# EAGLE design MakespaceBadge-5x5 (EAGLE 7.4.0)
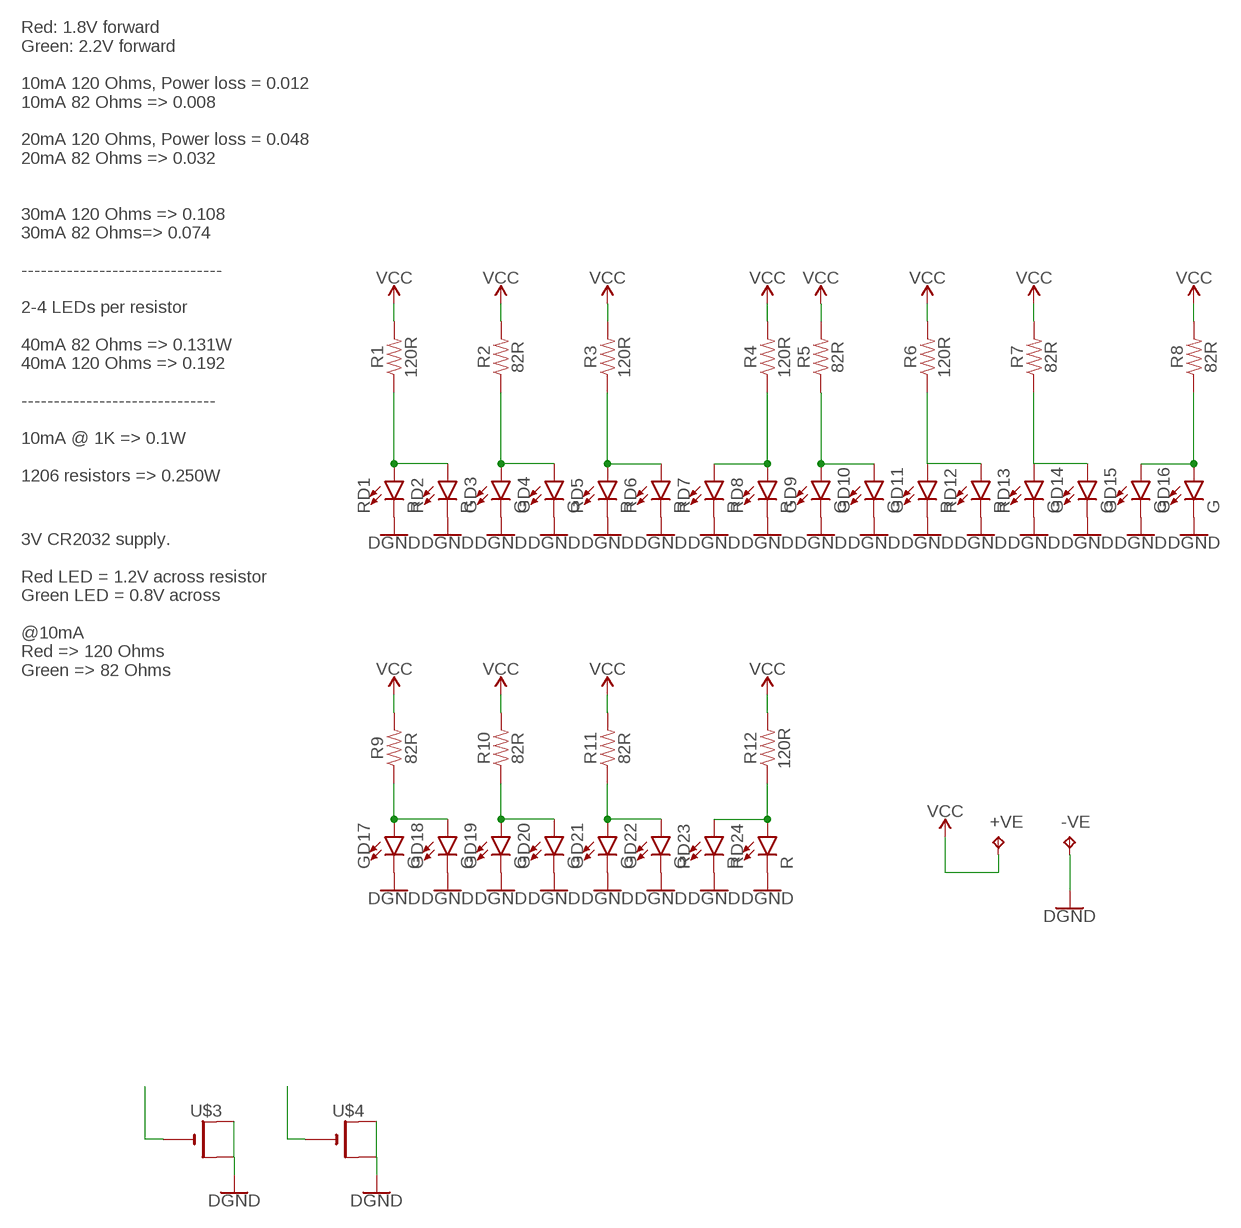
[diagram p0: schematic, sheet 1]

## Parts
+VE  TPTP20SQ  [TP20SQ]
-VE  TPTP20SQ  [TP20SQ]
GD3  G  LED3MM  [LED_3MM]
GD4  G  LED3MM  [LED_3MM]
GD9  G  LED3MM  [LED_3MM]
GD10  G  LED3MM  [LED_3MM]
GD11  R  LED3MM  [LED_3MM]
GD14  G  LED3MM  [LED_3MM]
GD15  G  LED3MM  [LED_3MM]
GD16  G  LED3MM  [LED_3MM]
GD17  G  LED3MM  [LED_3MM]
GD18  G  LED3MM  [LED_3MM]
GD19  G  LED3MM  [LED_3MM]
GD20  G  LED3MM  [LED_3MM]
GD21  G  LED3MM  [LED_3MM]
GD22  G  LED3MM  [LED_3MM]
R1  120R  RESISTOR1206  [1206]
R2  82R  RESISTOR1206  [1206]
R3  120R  RESISTOR1206  [1206]
R4  120R  RESISTOR1206  [1206]
R5  82R  RESISTOR1206  [1206]
R6  120R  RESISTOR1206  [1206]
R7  82R  RESISTOR1206  [1206]
R8  82R  RESISTOR1206  [1206]
R9  82R  RESISTOR1206  [1206]
R10  82R  RESISTOR1206  [1206]
R11  82R  RESISTOR1206  [1206]
R12  120R  RESISTOR1206  [1206]
RD1  R  LED3MM  [LED_3MM]
RD2  R  LED3MM  [LED_3MM]
RD5  R  LED3MM  [LED_3MM]
RD6  R  LED3MM  [LED_3MM]
RD7  R  LED3MM  [LED_3MM]
RD8  R  LED3MM  [LED_3MM]
RD12  R  LED3MM  [LED_3MM]
RD13  G  LED3MM  [LED_3MM]
RD23  R  LED3MM  [LED_3MM]
RD24  R  LED3MM  [LED_3MM]
U$3  CR1220SMT  [CR1220-SMD]
U$4  CR1220SMT  [CR1220-SMD]

## Nets
GND: -VE.TP GD3.K(C) GD4.K(C) GD9.K(C) GD10.K(C) GD11.K(C) GD14.K(C) GD15.K(C) GD16.K(C) GD17.K(C) GD18.K(C) GD19.K(C) GD20.K(C) GD21.K(C) GD22.K(C) RD1.K(C) RD2.K(C) RD5.K(C) RD6.K(C) RD7.K(C) RD8.K(C) RD12.K(C) RD13.K(C) RD23.K(C) RD24.K(C) U$3.+$1(+) U$3.+$2(+1) U$4.+$1(+) U$4.+$2(+1) ; supply symbol labelled DGND
N$1: R1.1 RD1.A RD2.A
N$2: U$3.-
N$3: GD3.A GD4.A R2.1
N$5: R4.1 RD7.A RD8.A
N$6: GD9.A GD10.A R5.1
N$7: GD14.A R7.1 RD13.A
N$8: GD21.A GD22.A R11.1
N$9: R12.1 RD23.A RD24.A
N$11: U$4.-
N$15: R3.1 RD5.A RD6.A
N$16: GD11.A R6.1 RD12.A
N$17: GD15.A GD16.A R8.1
N$21: GD17.A GD18.A R9.1
N$22: GD19.A GD20.A R10.1
VCC: +VE.TP R1.2 R2.2 R3.2 R4.2 R5.2 R6.2 R7.2 R8.2 R9.2 R10.2 R11.2 R12.2

## Notes on the sheet
- Red: 1.8V forward
  Green: 2.2V forward
  
  10mA 120 Ohms, Power loss = 0.012
  10mA 82 Ohms => 0.008
  
  20mA 120 Ohms, Power loss = 0.048
  20mA 82 Ohms => 0.032
  
  
  30mA 120 Ohms => 0.108
  30mA 82 Ohms=> 0.074
  
  -------------------------------
  
  2-4 LEDs per resistor
  
  40mA 82 Ohms => 0.131W
  40mA 120 Ohms => 0.192
  
  ------------------------------
  
  10mA @ 1K => 0.1W
  
  1206 resistors => 0.250W
- 3V CR2032 supply.
  
  Red LED = 1.2V across resistor
  Green LED = 0.8V across
  
  @10mA
  Red => 120 Ohms
  Green => 82 Ohms

## Library data of the parts
+VE -VE = testpad:TP: Test pad
GD3 GD4 GD9-GD11 GD14-GD22 RD1 RD2 RD5-RD8 RD12 RD13 RD23 RD24 = SparkFun-LED:LED: LED (Generic) Standard schematic elements and footprints for 5mm, 3mm, 1206, and 0603 sized LEDs. Generic LEDs with no color specified.; PROD_ID: DIO-08794
R1-R12 = SparkFun-Resistors:RESISTOR: Generic Resistor Package
U$3 U$4 = adafruit:CR1220: CR1216/CR1220/CR1225 12mm 3V lithium coin cell Great for battery packup. Both SMT and THM holders. Note the THM package has the ground pads on both sides of the PCB so that the masks are the same - this reduces the cost

## Board
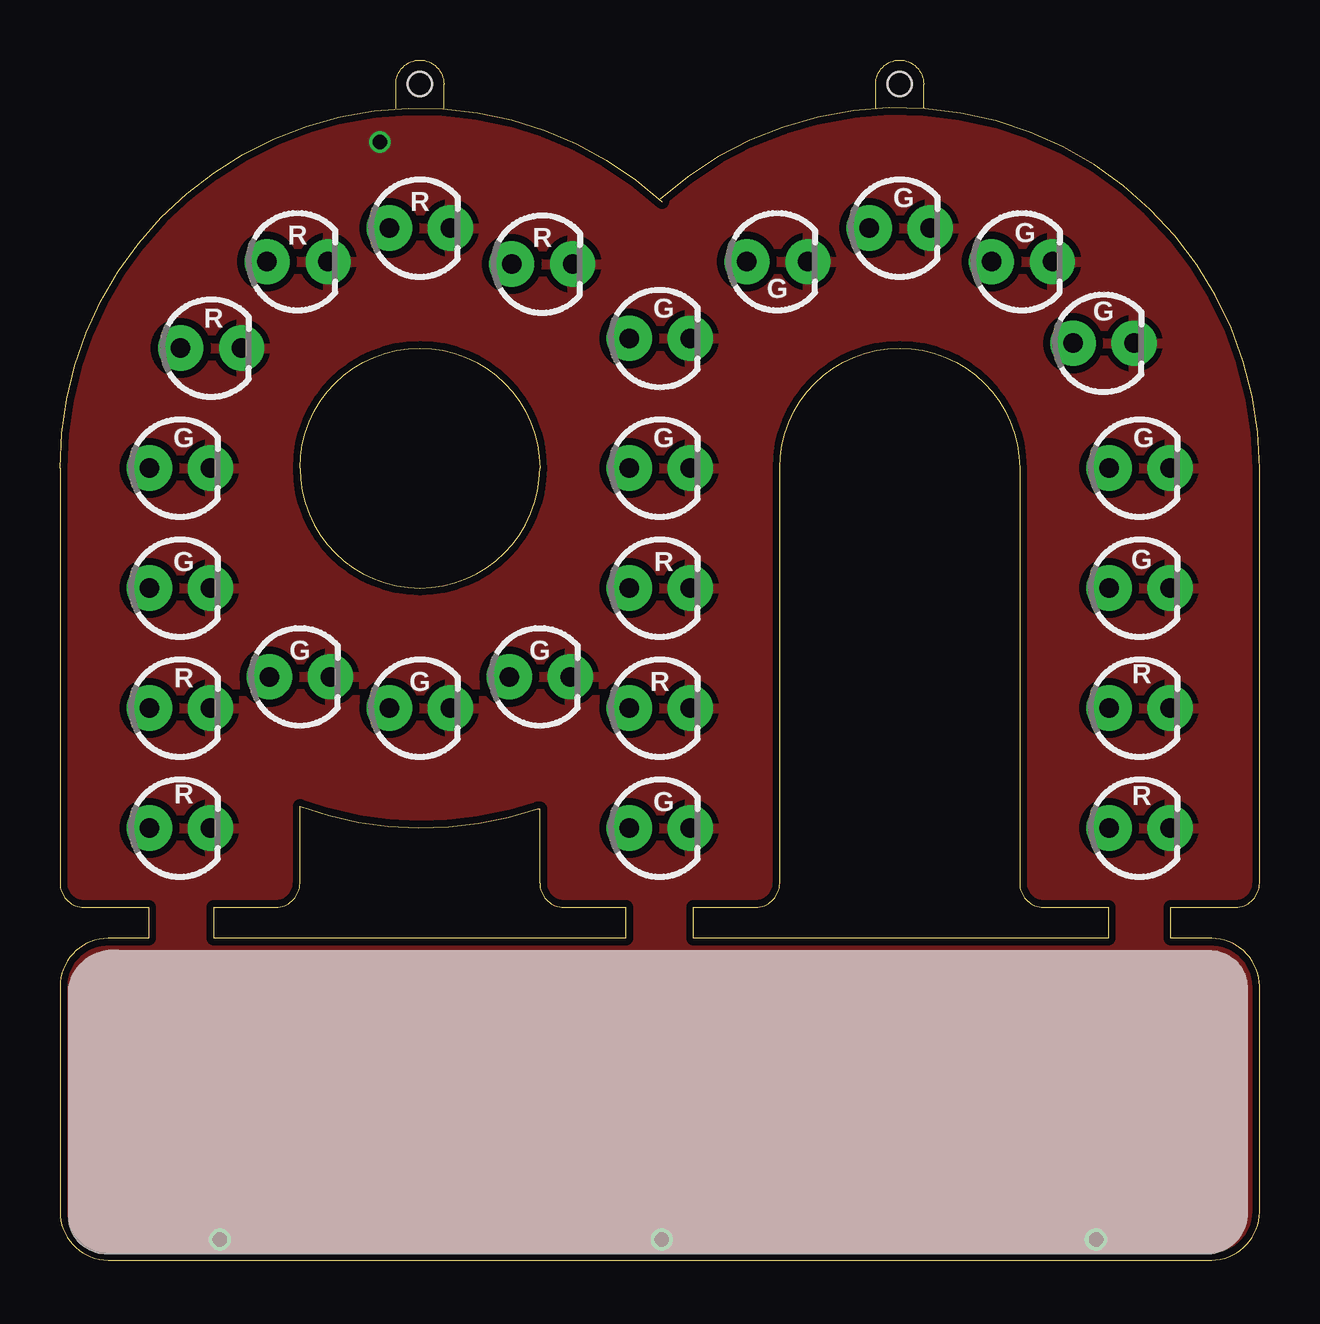
[diagram p1: board, top side]
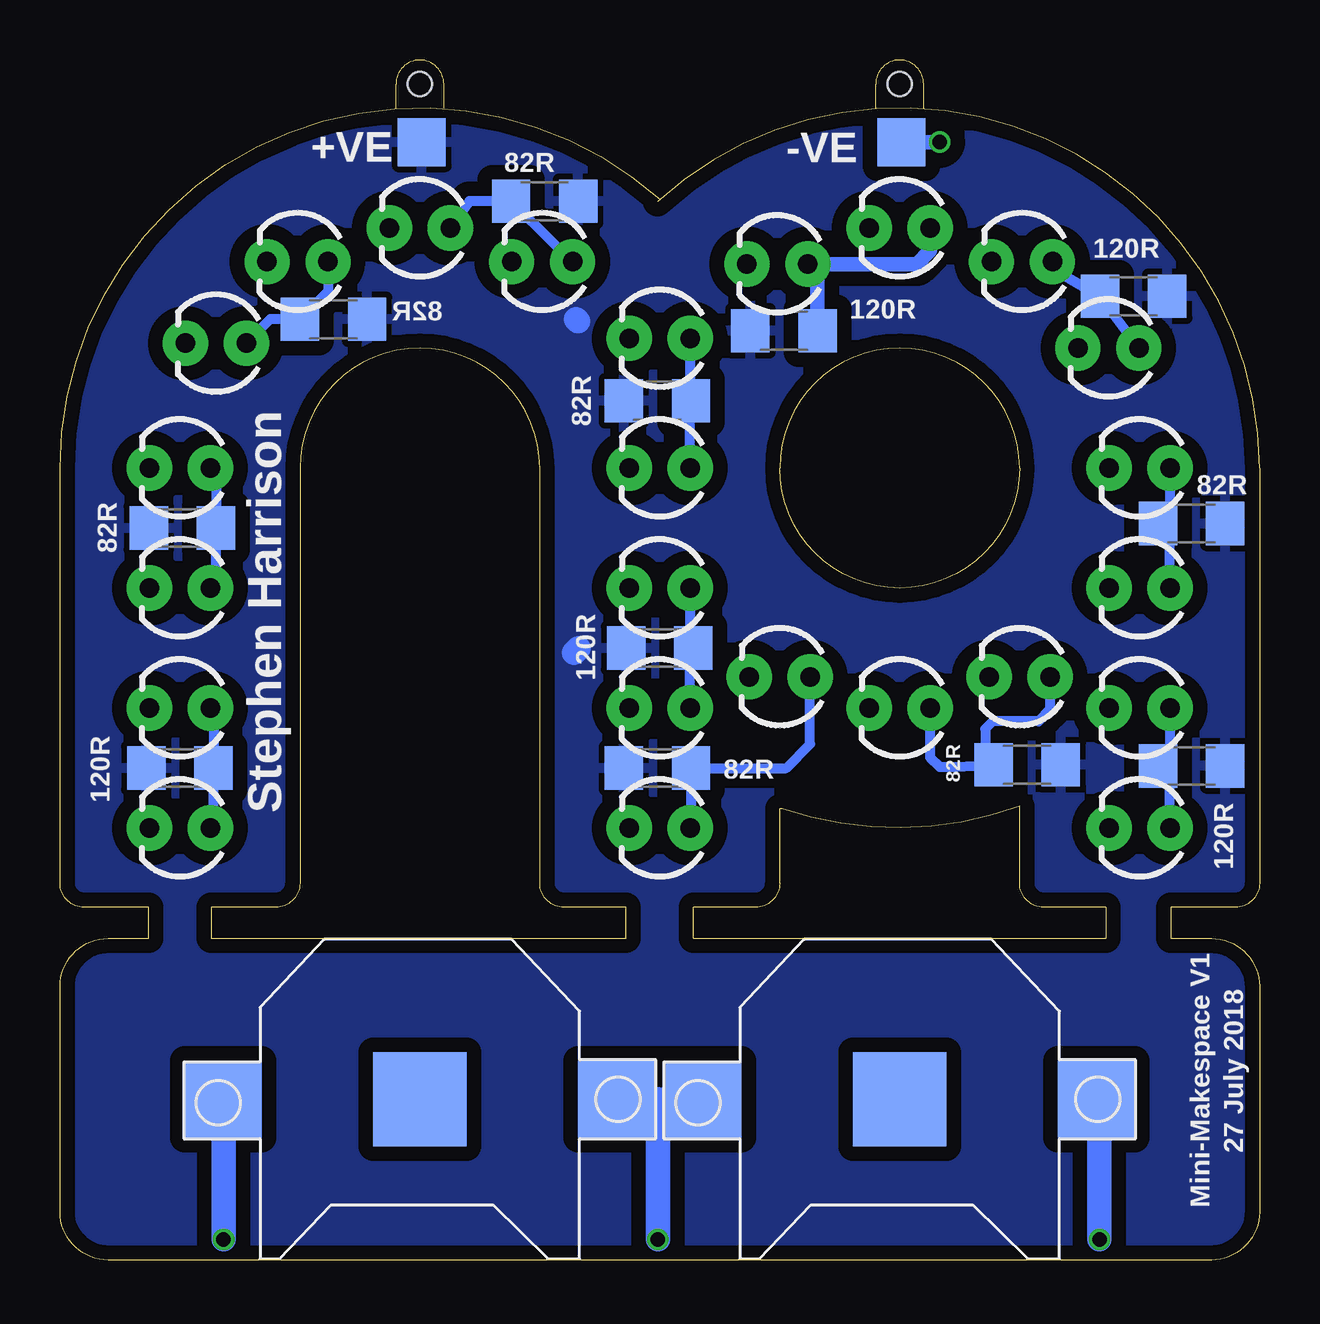
[diagram p2: board, bottom side, seen from below]

Size 50 x 50 mm. Coordinates in mm from the lower left corner, seen from the top.
Outline: 25,44.2 arc-132 50,33 50,15.7 arc-90 49,14.7 46.3,14.7 46.3,13.4 48,13.4 arc-90 50,11.4 50,2 arc-90 48,0 2,0 arc-90 0,2 0,11.4 arc-90 2,13.4 3.7,13.4 3.7,14.7 1,14.7 arc-90 0,15.7 0,33 arc-132 25.1,44.1
Outline: 14,48 14,49 arc-180 16,49 16,48
Outline: 34,48 34,49 arc-180 36,49 36,48
Outline: 6.4,14.7 9,14.7 arc90 10,15.7 10,18.9 arc39 19.9,18.8 20,18.8 20,15.7 arc90 21,14.7 23.6,14.7 23.6,13.4 6.4,13.4 6.4,14.7
Outline: 26.4,14.7 29,14.7 arc90 30,15.7 30,33 arc-180 40,33 40,15.7 arc90 41,14.7 43.7,14.7 43.7,13.4 26.4,13.4 26.4,14.7
Outline: 10,33 arc-180 20,33 arc-180 10,33
Copper layers (1*16): Top 0.035mm / dielectric 1.5mm / Bottom 0.035mm
Design rules "dirt_cheap_dirty_boards.v1": minimum track width 5mil, minimum drill 12mil, track to track 5mil, track to pad 5mil, pad to pad 5mil, via to via 5mil, smd to smd 0mil, copper to edge 10mil, drill to drill 10mil, minimum pad ring 10mil, minimum via ring 6mil, stop-mask expansion 2mil, vias tented up to drill 25mil, thermal gap 10mil
Holes 1 mm at 35,49 15,49

### Footprints (pad centres in the part's own frame; a part is rotated, then mirrored left to right if it is on the bottom)
TP20SQ = smd 2 x 2: TP 0,0
LED_3MM = drill 0.813 pad 1.88: A -1.27,0; K 1.27,0
1206 = smd 1.6 x 1.8: 1 -1.4,0; 2 1.4,0
CR1220-SMD = smd 3.2 x 3.2: +$1 -8.2,0; +$2 8.2,0 | smd 3.9 x 3.9: - 0,0

### Placement (x,y rotation side)
+VE  34.92,46.58 0 bottom
-VE  14.92,46.58 0 bottom
GD3  5,28 0 top
GD4  5,33 0 top
GD9  25,38.4 0 top
GD10  25,33 0 top
GD11  25,28 0 top
GD14  20,24.3 0 top
GD15  15,23 0 top
GD16  10,24.3 0 top
GD17  29.9,41.6 0 top
GD18  35,43 0 top
GD19  40.1,41.6 0 top
GD20  43.5,38.2 0 top
GD21  45,33 0 top
GD22  45,28 0 top
R1  2.84,20.59 0 bottom
R2  2.84,30.69 0 bottom
R3  5.25,40.16 0 bottom
R4  19.82,38.72 180 bottom
R5  25.1,35.8 180 bottom
R6  25,25.5 180 bottom
R7  25.1,20.5 180 bottom
R8  9.69,20.64 0 bottom
R9  29.8,44.12 0 bottom
R10  38.6,39.2 0 bottom
R11  44.9,30.5 180 bottom
R12  45,20.5 180 bottom
RD1  5,18 0 top
RD2  5,23 0 top
RD5  6.3,38 0 top
RD6  9.9,41.6 0 top
RD7  15,43 0 top
RD8  20.1,41.5 0 top
RD12  25,23 0 top
RD13  25,18 0 top
RD23  45,23 0 top
RD24  45,18 0 top
U$3  15,6.7 180 bottom
U$4  35,6.7 180 bottom

### Tracks (layer width: path | path; a pad name or v marks a point on that pad's centre or on a via)
GND  (via drill 0.6)
  Bottom 0.61: v13.34,46.58 -VE.TP | U$3.+$2 25.08,6.7 U$4.+$1 26.73,6.84
  Bottom 1.016: v6.67,0.86 6.67,6.57 U$3.+$1 | v25.08,0.86 25.08,6.7 | v43.18,0.86 43.18,6.68 U$4.+$2
  pour Top (isolate 0.305): 1.2,-0.2 50.1,-0.1 50,48.5 0.1,48.5 0.1,-0.2
N$1
  Bottom 0.406: RD2.A 3.73,21.16 R1.1 3.73,19.84 RD1.A
N$3
  Bottom 0.406: GD3.A 3.73,30.37 R2.1 3.73,30.43 GD4.A
N$5
  Bottom 0.61: R4.1 18.43,41.09 RD8.A 14.29,41.5 13.73,42.05 RD7.A
N$6
  Bottom 0.406: GD9.A 23.73,35.83 R5.1 23.73,35.77 GD10.A
N$7
  Bottom 0.406: RD13.A 23.7,18.03 R7.1 19.73,20.5 18.73,21.5 GD14.A
N$8
  Bottom 0.406: GD22.A 43.5,28 R11.1 43.5,33 GD21.A
N$9
  Bottom 0.406: RD23.A 43.6,23 R12.1 43.6,18 RD24.A
N$15
  Bottom 0.406: RD5.A 5.1,38.07 R3.1 8.57,41.27 8.57,41.5 8.36,41.6 RD6.A
N$16
  Bottom 0.406: GD11.A 23.73,25.63 R6.1 23.73,25.37 RD12.A
N$17
  Bottom 0.406: GD15.A 13.73,20.94 13.34,20.54 12.63,20.54 R8.1 11.43,20.98 11.43,22.13 11.11,22.45 9.21,22.45 8.73,22.93 GD16.A
N$21
  Bottom 0.406: GD18.A 32.93,44.12 R9.1 30.85,43.77 GD17.A
N$22
  Bottom 0.406: GD20.A 41.23,39.2 R10.1 38.83,40.37 GD19.A
VCC
  Bottom 0.61: R4.2 21.23,38.91
  Bottom 1.016: 26.54,20.54 R7.2 | 28.38,25.5 28.57,25.3 | 28.5,39.2 28.42,39.12 | R10.2 37.22,39.2 | 46.44,20.54 R12.2 | R3.2 3.74,40.16
  pour Bottom (isolate 0.61): 1.2,-0.2 50.1,-0.1 50,48.4 0.1,49.67 0,-0.2

### Text on the board
bNames: Stephen Harrison | Mini-Makespace V1 | 27 July 2018